# Altium schematic sheet Sheet2.SchDoc
size 594 x 420 mm; SheetNumber: 2; SheetTotal: 3; PageSetup: Record=PageOptions|CenterHorizontal=True|CenterVertical=True|PrintScale=0.94|XCorrection=1.00|YCorrection=1.00|PrintKind=1|BorderSize=5000000|LeftOffset=0|BottomOffset=0|Orientation=1|PaperLength=1000|PaperWidth=1000|Scale=100|PaperSource=7|PrintQuality=-4|MediaType=1|DitherType=10|PaperKind=A4|PrintScaleMode=1; DecimalNumber: Децимальный номер; HeadOfSector: Нач. сектора; MainDevice: Перв.примен.; Name1: Наименование1; lit_A: О; n_kontr: Н. Контр; t_kontr: Т. Контр; Name2: Наименование2
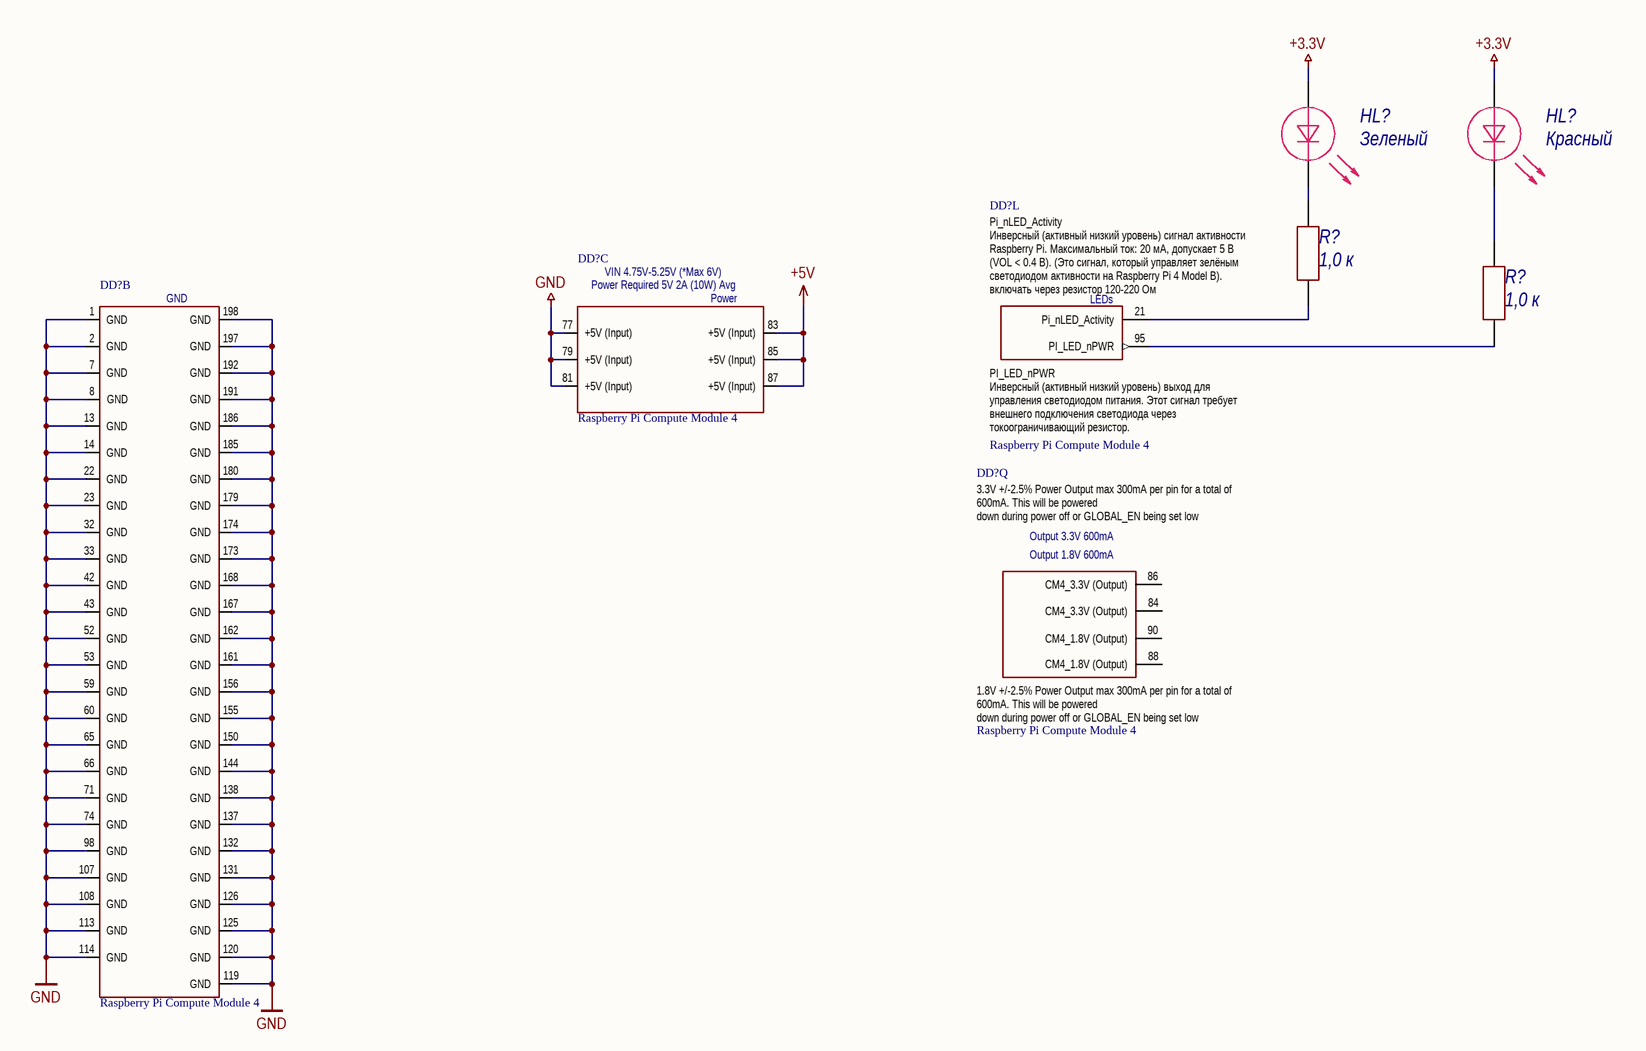
[diagram p0: Sheet2.SchDoc]

## Parts
(Parts that share a designator on the sheet are numbered #1, #2 ... from top to bottom, then left to right.)
DD?#1  Raspberry Pi Compute Module 4  [CM4-F40C-100DS-0.4v_1.5mm_0mm]  (part B of 21)  (no BOM)
DD?#2  Raspberry Pi Compute Module 4  [CM4-F40C-100DS-0.4v_1.5mm_0mm]  (part C of 21)  (no BOM)
DD?#3  Raspberry Pi Compute Module 4  [CM4-F40C-100DS-0.4v_1.5mm_0mm]  (part L of 21)  (no BOM)
DD?#4  Raspberry Pi Compute Module 4  [CM4-F40C-100DS-0.4v_1.5mm_0mm]  (part Q of 21)  (no BOM)
HL?#1  Color: Зеленый  [0805D]  (hidden comment: LED)
HL?#2  Color: Красный  [0805D]  (hidden comment: LED)
R?#1  value 1,0 к  [0603R]  (hidden comment: Resistor)
R?#2  value 1,0 к  [0603R]  (hidden comment: Resistor)

## Nets
+3.3V: HL?#1.1 HL?#2.1
+5V: DD?#2.83(+5V_(Input)) DD?#2.85(+5V_(Input)) DD?#2.87(+5V_(Input))
GND: DD?#1.1(GND) DD?#1.2(GND) DD?#1.7(GND) DD?#1.8(GND) DD?#1.13(GND) DD?#1.14(GND) DD?#1.22(GND) DD?#1.23(GND) DD?#1.32(GND) DD?#1.33(GND) DD?#1.42(GND) DD?#1.43(GND) DD?#1.52(GND) DD?#1.53(GND) DD?#1.59(GND) DD?#1.60(GND) DD?#1.65(GND) DD?#1.66(GND) DD?#1.71(GND) DD?#1.74(GND) DD?#1.98(GND) DD?#1.107(GND) DD?#1.108(GND) DD?#1.113(GND) DD?#1.114(GND) DD?#1.119(GND) DD?#1.120(GND) DD?#1.125(GND) DD?#1.126(GND) DD?#1.131(GND) DD?#1.132(GND) DD?#1.137(GND) DD?#1.138(GND) DD?#1.144(GND) DD?#1.150(GND) DD?#1.155(GND) DD?#1.156(GND) DD?#1.161(GND) DD?#1.162(GND) DD?#1.167(GND) DD?#1.168(GND) DD?#1.173(GND) DD?#1.174(GND) DD?#1.179(GND) DD?#1.180(GND) DD?#1.185(GND) DD?#1.186(GND) DD?#1.191(GND) DD?#1.192(GND) DD?#1.197(GND) DD?#1.198(GND) DD?#2.77(+5V_(Input)) DD?#2.79(+5V_(Input)) DD?#2.81(+5V_(Input))
NetDD?#3_21: DD?#3.21(Pi_nLED_Activity) R?#1.1
NetDD?#3_95: DD?#3.95(PI_LED_nPWR) R?#2.1
NetHL?#1_2: HL?#1.2 R?#1.2
NetHL?#2_2: HL?#2.2 R?#2.2

Not connected (* = marked no-connect by the designer): DD?#4 84(CM4_3.3V_(Output)) 86(CM4_3.3V_(Output)) 88(CM4_1.8V_(Output)) 90(CM4_1.8V_(Output))

## Notes on the sheet
- Перв.примен.
- Справ.№
- Подп. и дата
- Инв.№ дубл.
- Взам.инв.№
- Подп.и дата
- Разраб.
- Изм.
- Лист
- № докум.
- Подп.
- Дата
- Лит.
- Масштаб
- Масса
- Т. контр
- Пров.
- Схема электрическая принципиальная
- Листов
- Инв.№ подл.
- Утв.
- Н.контр.
- Формат  A2
- (in symbol CM4, part C) VIN 4.75V-5.25V (*Max 6V); Power Required 5V 2A (10W) Avg; Power
- (in symbol CM4, part L) Pi_nLED_Activity / Инверсный (активный низкий уровень) сигнал активности Raspberry Pi. Максимальный ток: 20 мА, допускает 5 В (VOL < 0.4 В). (Это сигнал, который управляет зелёным светодиодом активности на Raspberry Pi 4 Model B). включать через резистор 120-220 Ом; LEDs; PI_LED_nPWR / Инверсный (активный низкий уровень) выход для управления светодиодом питания. Этот сигнал требует внешнего подключения светодиода через токоограничивающий резистор.
- (in symbol CM4, part Q) 3.3V +/-2.5% Power Output max 300mA per pin for a total of 600mA. This will be powered / down during power off or GLOBAL_EN being set low; Output 3.3V 600mA; Output 1.8V 600mA; 1.8V +/-2.5% Power Output max 300mA per pin for a total of 600mA. This will be powered / down during power off or GLOBAL_EN being set low

## Library data of the parts
DD?#1-DD?#4 = CM4: Raspberry Pi Compute Module 4 by Amornthep Phunsin
HL?#1 HL?#2 = LED: Светодиод; Part Number: LED
R?#1 R?#2 = Resistor_1.0k_1_0603: Резистор номиналом 1,0 кОм и точностью 1%; Power: *; Part Number: Resistor_1.0k_1_0603; Tolerance: 1%